# EasyEDA schematic SCH_TIMER_2025-06-27.json
TITLE: Sheet_1; REV: 1.0; Date: 2025-06-25; Sheet: 1/1; Drawn By: GOD_SLAYER; Company: Your Company
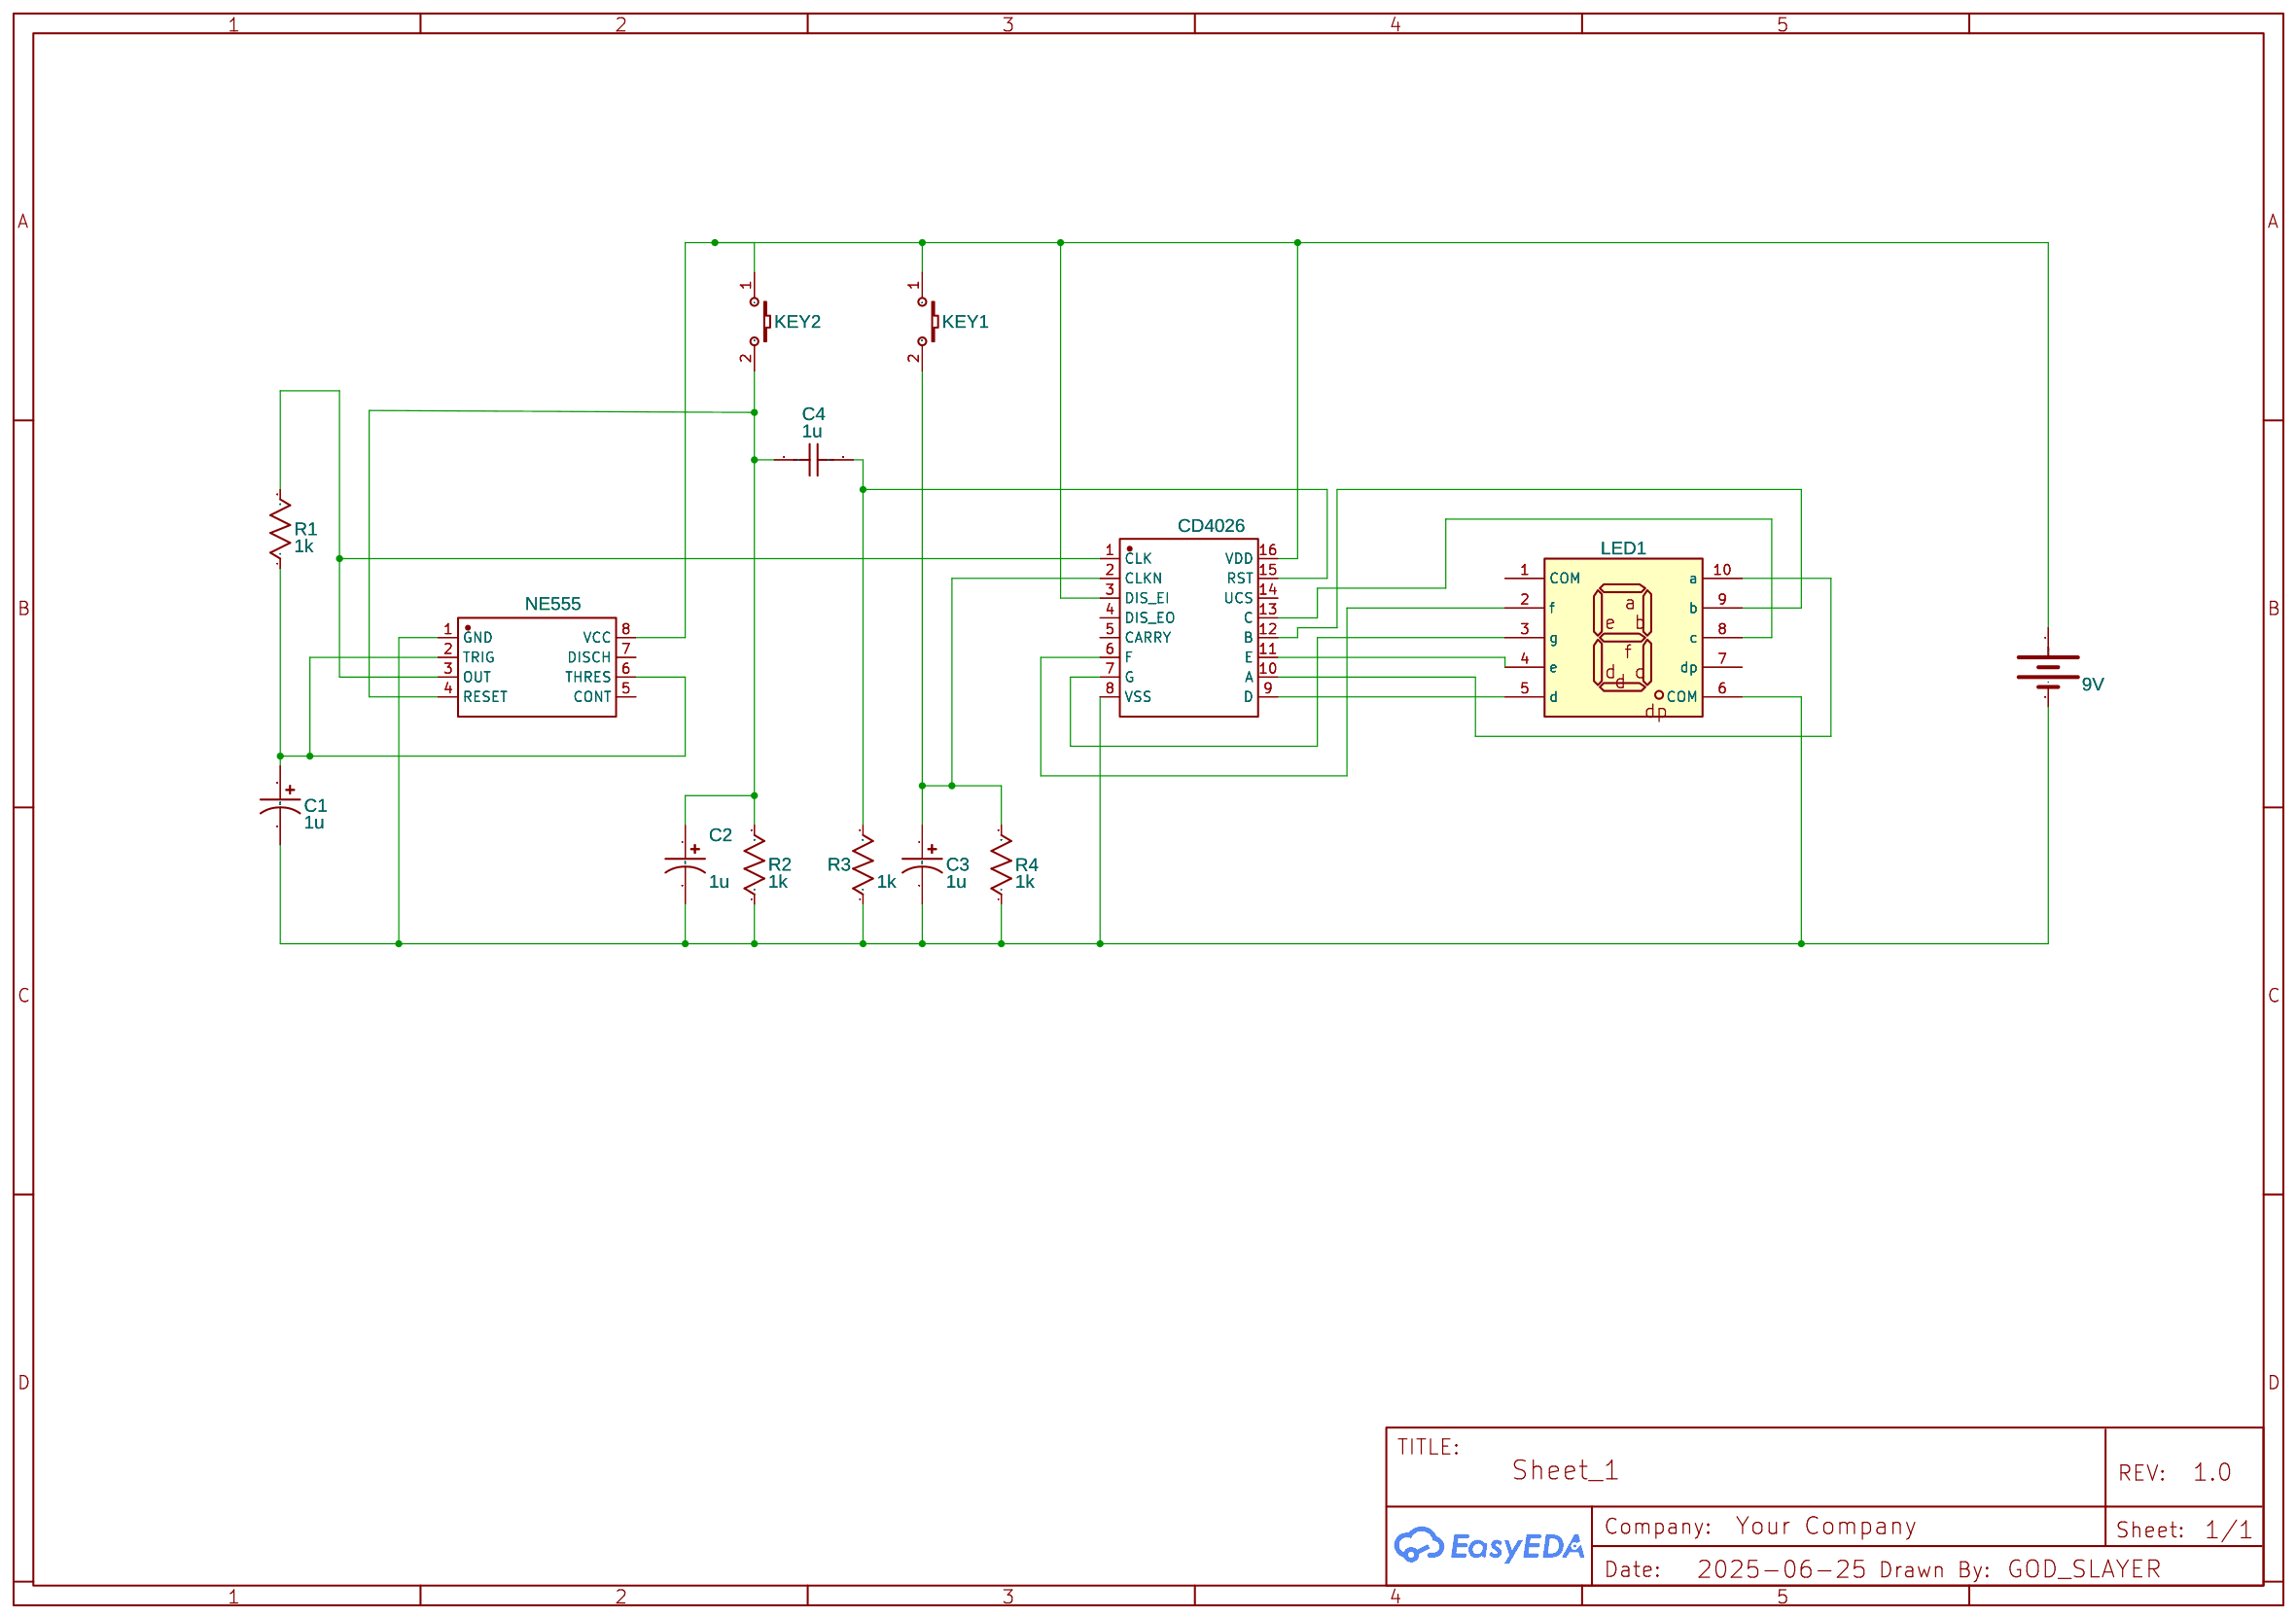
[diagram p0: schematic sheet]

## Parts
BT1  9V  [BAT-TH_2P-9VBATTERY]
C1  1u  [CAP-D4.0×H5.5]
C2  1u  [CAP-D4.0×H5.5]
C3  1u  [CAP-D4.0×H5.5]
C4  1u  [RAD-0.1]
KEY1  K2-3.6×6.1_SMD  [KEY-SMD_2P-L6.2-W3.6-LS8.0]
KEY2  K2-3.6×6.1_SMD  [KEY-SMD_2P-L6.2-W3.6-LS8.0]
LED1  FJ3161BH  [LED-SEG-TH_FJ3161BH]
R1  1k  [R_AXIAL-0.3]
R2  1k  [R_AXIAL-0.3]
R3  1k  [R_AXIAL-0.3]
R4  1k  [R_AXIAL-0.3]
U1  NE555  [PDIP-8_L9.6-W6.4-P2.54-LS7.9-BL-1]
U2  CD4026  [PDIP-16_L19.3-W6.4-P2.54-LS7.94-BL]

## Library data of the parts
BT1 = 9V电池铜线扣 铜100MM: Supplier: LCSC; Supplier Part: C70374; Manufacturer: Q&J; Manufacturer Part: 9V电池铜线扣 铜100mm; JLCPCB Part Class: Extended Part; Contributor: lcsc
C1-C3 = CE_SMD_D4.0×H5.5_US: Contributor: LCEDA_Lib
C4 = C_RAD-0.1_US: Contributor: LCEDA_Lib
KEY1 KEY2 = K2-3.6×6.1_SMD: Supplier Part: C118141; Supplier: LCSC; Manufacturer Part: K2-1107ST-A4SW-06; Contributor: LCEDA_Lib; 制造商: 韩国韩荣
LED1 = FJ3161BH: Supplier: LCSC; Manufacturer: 志浩; Supplier Part: C10690; JLCPCB Part Class: Extended Part
R1-R4 = R_AXIAL-0.3_US: Contributor: LCEDA_Lib
U1 = NE555PE4: Contributor: lcsc; Supplier: LCSC; Supplier Part: C2859604; Manufacturer: TI(德州仪器); JLCPCB Part Class: Extended Part
U2 = CD4026BE(LX): Supplier: LCSC; Supplier Part: C22397238; Manufacturer: LX(灵星芯微); Contributor: lcsc; JLCPCB Part Class: Extended Part

## Nets
Net-(BT1-1): BT1.1(+) KEY1.1 KEY2.1 U1.8(VCC) U2.3(DIS_EI) U2.16(VDD)
Net-(BT1-2): BT1.2(-) C1.2 C2.2 C3.2 LED1.6(COM) R2.1 R3.1 R4.1 U1.1(GND) U2.8(VSS)
Net-(C1-1): C1.1 R1.1 U1.2(TRIG) U1.6(THRES)
Net-(C2-1): C2.1 C4.1 KEY2.2 R2.2 U1.4(RESET)
Net-(C3-1): C3.1 KEY1.2 R4.2 U2.2(CLKN)
Net-(C4-2): C4.2 R3.2 U2.15(RST)
Net-(LED1-2): LED1.2(f) U2.6(F)
Net-(LED1-3): LED1.3(g) U2.7(G)
Net-(LED1-4): LED1.4(e) U2.11(E)
Net-(LED1-5): LED1.5(d) U2.9(D)
Net-(LED1-8): LED1.8(c) U2.13(C)
Net-(LED1-9): LED1.9(b) U2.12(B)
Net-(LED1-10): LED1.10(a) U2.10(A)
Net-(R1-2): R1.2 U1.3(OUT) U2.1(CLK)

Not connected (* = marked no-connect by the designer): LED1 1(COM) 7(dp); U1 5(CONT) 7(DISCH); U2 4(DIS_EO) 5(CARRY) 14(UCS)
